# Altium schematic sheet PowerSupply.SchDoc
size A4
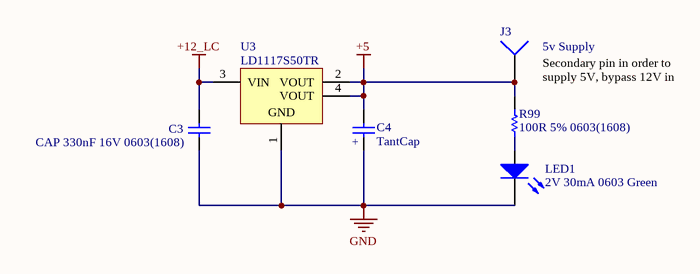
[diagram p0: PowerSupply.SchDoc]

## Parts
C3  CAP 330nF 16V 0603(1608)  [CAPC0603(1608)100_M]
C4  TantCap  [TantCap_2917 (7343)]
J3  5v Supply  [PIN1]
LED1  2V 30mA 0603 Green  [0603_A]
R99  100R 5% 0603(1608)  [RESC0603(1608)_L]
U3  LD1117S50TR  [SOT-223_L]

## Nets
+5: C4.2 J3.1 R99.1 U3.2(VOUT) U3.4(VOUT)
+12_LC: C3.2 U3.3(VIN)
GND: C3.1 C4.1 LED1.1(K) U3.1(GND)
NetLED1_2: LED1.2(A) R99.2

## Notes on the sheet
- Secondary pin in order to supply 5V, bypass 12V in
- Title
- Size:
- Date:
- A4
- Number:
- Time:
- Revision:
- Sheet
- of
- File:
- (in symbol TantCap) +

## Library data of the parts
C3 = CMP-1035-02670-1: CAP 330nF 16V ±5% 0603 (1608 Metric) Thickness 1mm SMD; Case-Metric: 1608; Tolerance: Â±5%; Case-EIA: 0603; Rated Voltage: 16 V; Max Thickness: 1 mm; Value: 330nF; Technology: SMT
J3 = Socket: LatestRevisionDate: 17-Jul-2002; LatestRevisionNote: Re-released for DXP Platform.; Publisher: Altium Limited
LED1 = CMP-1426-00006-1: SMD mono-color Chip LED, WL-SMCW, Bright Green; PartNumber: 150060VS75000; Manufacturer: Wuerth Elektronik; ComponentLink2URL: http://katalog.we-online.com/led/datasheet/150060VS75000.pdf; ComponentLink1Description: Manufacturer URL; PackageReference: 0603_A; ComponentLink2Description: Datasheet; ComponentLink1URL: http://www.we-online.com; Color: Bright Green
R99 = CMP-1012-00050-1: 100R 0.1W 5% 0603 (1608 Metric)  SMD; Case-EIA: 0603; Value: 100.00 Ohm; Case-Metric: 1608; Tolerance: 5 %; Technology: SMT; Power: 0.1 W
U3 = CMP-0244-00312-1: Fixed Low Drop Positive Voltage Regulator, 5V, 4-Pin SOT-223, Tape and Reel; ComponentLink1URL: http://www.st.com; DatasheetVersion: 1/11/2011; PackageDescription: 4-Pin SOT-223 Package, 6.5 x 3.5 mm Body, 2.3 mm Pitch, 7 mm Lead Span; ComponentLink2URL: http://www.st.com/internet/com/TECHNICAL_RESOURCES/TECHNICAL_LITERATURE/DATASHEET/CD00000544.pdf; ComponentLink1Description: Manufacturer URL; PackageReference: SOT-223; PackageVersion: 2010; ComponentLink2Description: Datasheet